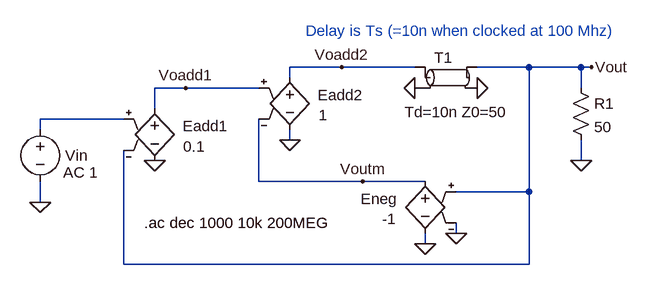
[diagram p0: schematic _Fig3_28_MSD_alt.asc]
_Fig3_28_MSD_alt.asc, the LTspice schematic file:
Version 4
SHEET 1 2740 696
WIRE 896 -432 816 -432
WIRE 1008 -432 896 -432
WIRE 1184 -432 1104 -432
WIRE 1264 -432 1184 -432
WIRE 1280 -432 1264 -432
WIRE 816 -416 816 -432
WIRE 656 -400 608 -400
WIRE 768 -400 656 -400
WIRE 1264 -400 1264 -432
WIRE 608 -368 608 -400
WIRE 560 -352 432 -352
WIRE 432 -336 432 -352
WIRE 816 -320 816 -336
WIRE 1264 -288 1264 -320
WIRE 768 -256 768 -352
WIRE 928 -256 768 -256
WIRE 1024 -256 928 -256
WIRE 1184 -240 1184 -432
WIRE 1184 -240 1072 -240
WIRE 432 -224 432 -256
WIRE 1072 -176 1072 -192
WIRE 1024 -160 1024 -176
WIRE 560 -128 560 -304
WIRE 1184 -128 1184 -240
WIRE 1184 -128 560 -128
FLAG 1104 -400 0
FLAG 1008 -400 0
FLAG 608 -288 0
FLAG 656 -400 Voadd1
FLAG 432 -224 0
FLAG 896 -432 Voadd2
FLAG 1280 -432 Vout
FLAG 1264 -288 0
FLAG 816 -320 0
FLAG 1024 -160 0
FLAG 1072 -176 0
FLAG 928 -256 Voutm
SYMBOL tline 1056 -416 R0
WINDOW 0 -18 -31 Left 0
WINDOW 3 -63 53 Left 0
SYMATTR InstName T1
SYMATTR Value Td=10n Z0=50
SYMBOL e 608 -384 R0
WINDOW 0 43 43 Left 0
WINDOW 3 44 74 Left 0
SYMATTR InstName Eadd1
SYMATTR Value 0.1
SYMBOL voltage 432 -352 R0
WINDOW 0 38 56 Left 0
WINDOW 123 35 82 Left 0
WINDOW 39 0 0 Left 0
SYMATTR InstName Vin
SYMATTR Value2 AC 1
SYMATTR Value ""
SYMBOL e 816 -432 R0
WINDOW 0 43 43 Left 0
WINDOW 3 44 74 Left 0
SYMATTR InstName Eadd2
SYMATTR Value 1
SYMBOL res 1248 -416 R0
SYMATTR InstName R1
SYMATTR Value 50
SYMBOL e 1024 -272 M0
WINDOW 0 43 43 Left 0
WINDOW 3 44 74 Left 0
SYMATTR InstName Eneg
SYMATTR Value -1
TEXT 592 -192 Left 0 !.ac dec 1000 10k 200MEG
TEXT 840 -488 Left 0 ;Delay is Ts (=10n when clocked at 100 Mhz)

The netlist it stands for:
* _Fig3_28_MSD_alt.asc
T1 Voadd2 0 Vout 0 Td=10n Z0=50
Eadd1 Voadd1 0 N001 Vout 0.1
Vin N001 0 AC 1
Eadd2 Voadd2 0 Voadd1 Voutm 1
R1 Vout 0 50
Eneg Voutm 0 Vout 0 -1
.ac dec 1000 10k 200MEG
* Delay is Ts (=10n when clocked at 100 Mhz)
.backanno
.end